# Altium schematic sheet 1_V1.schdoc
size 708 x 330 mm; Name: A_A3; Symbol: A_A3; Device: A_A3; @Project Name: samrtclick; REV: 1.0; Date: 2023-02-28; Sheet: 1/1; Draw By: kano; Company: Your Company; Convert to PCB: yes; Add into BOM: yes
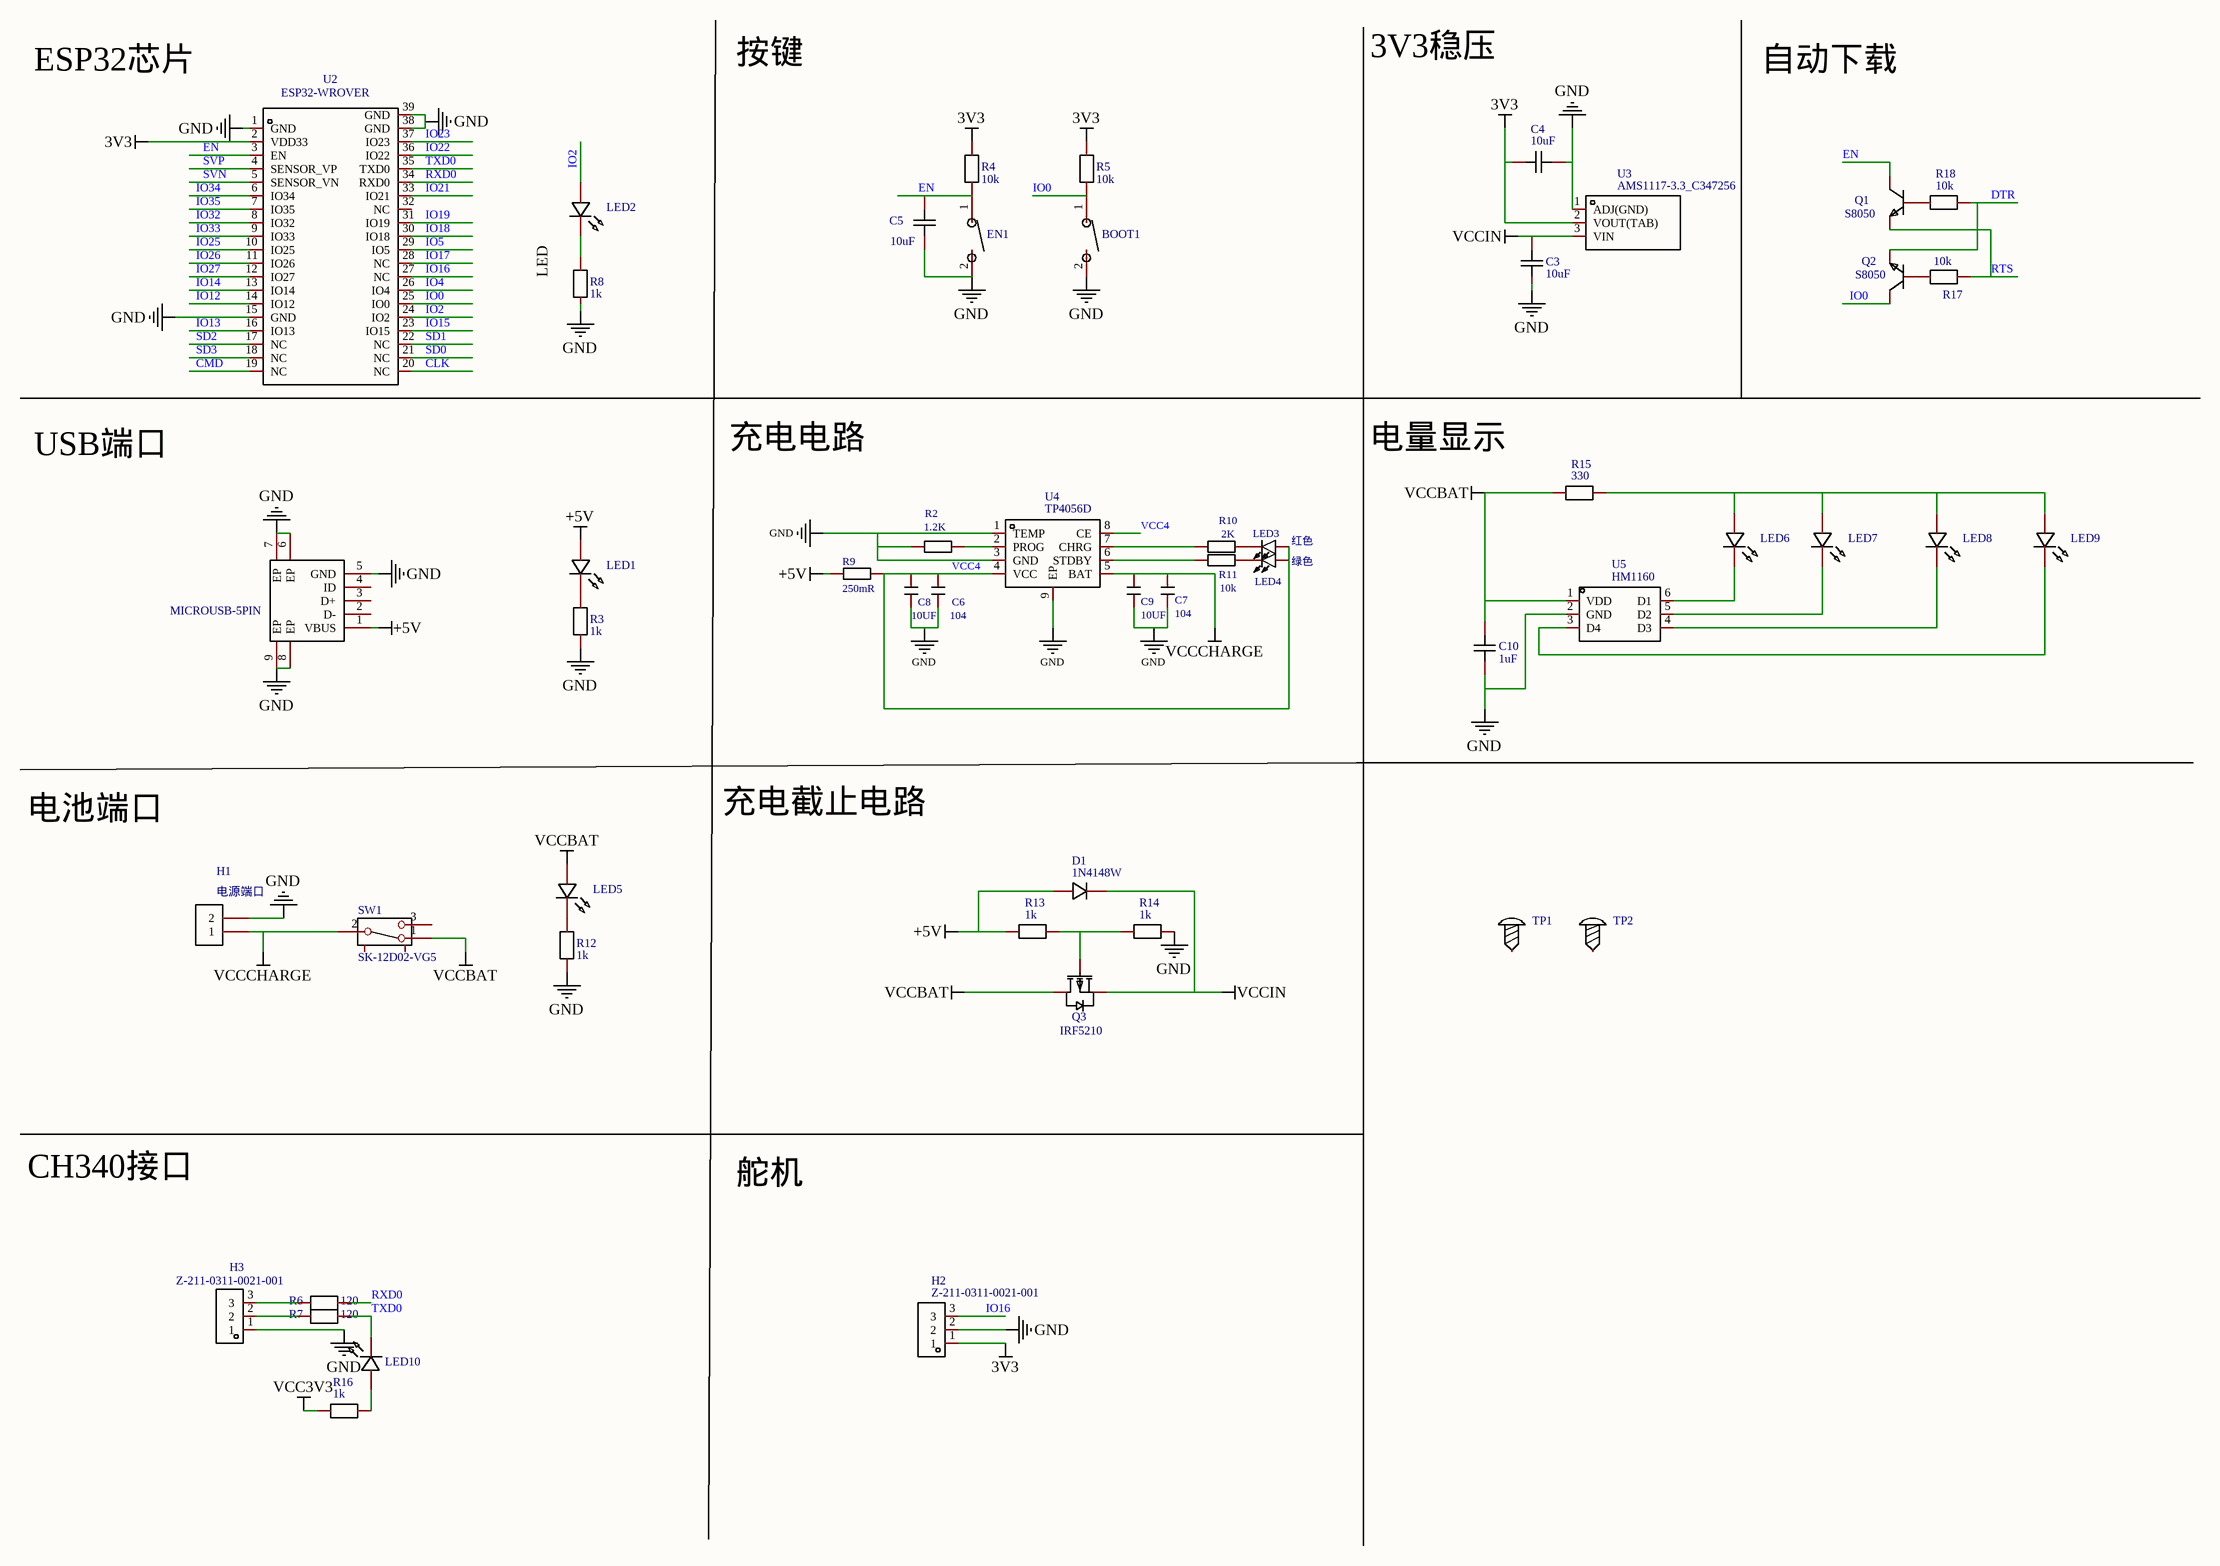
[diagram p0: 1_V1.schdoc]

## Parts
BOOT1  TSA343G00D-250J2  [SW-SMD_L4.0-W2.9-P4.15-EH]  (value not drawn)
C3  10uF  [C0805]
C4  10uF  [C0805]
C5  10uF  [C0603]
C6  104  [C0603]
C7  104  [C0603]
C8  10UF  [C0805]
C9  10UF  [C0805]
C10  1uF  [C0805]
D1  1N4148W  [SOD-123FL_L2.6-W1.6-LS3.4-RD]
EN1  TSA343G00D-250J2  [SW-SMD_L4.0-W2.9-P4.15-EH]  (value not drawn)
H1  电源端口  [HDR-TH_2P-P2.54-V-M-1]
H2  Z-211-0311-0021-001  [HDR-TH_3P-P2.54-V-M-1]
H3  Z-211-0311-0021-001  [HDR-TH_3P-P2.54-V-M-1]
LED1  LED-0603_R  [LED0603_RED]  (value not drawn)
LED2  LED-0603_R  [LED0603_RED]  (value not drawn)
LED3  红色  [L0603-RD]
LED4  绿色  [L0603-RD]
LED5  LED-0603_R  [LED0603_RED]  (value not drawn)
LED6  LED-0603_R  [LED0603_RED]  (value not drawn)
LED7  LED-0603_R  [LED0603_RED]  (value not drawn)
LED8  LED-0603_R  [LED0603_RED]  (value not drawn)
LED9  LED-0603_R  [LED0603_RED]  (value not drawn)
LED10  LED-0603_R  [LED0603_RED]  (value not drawn)
NO1  MICROUSB-5PIN  [USB-SMD_5P_MICROUSB-5PIN]
Q1  S8050  [SOT-23-3_L2.9-W1.3-P1.90-LS2.4-BR]
Q2  S8050  [SOT-23-3_L2.9-W1.3-P1.90-LS2.4-BR]
Q3  IRF5210  [TO-263-2_L10.0-W9.1-P5.08-LS15.2-BR]
R2  1.2K  [R0603]
R3  1k  [R0603]
R4  10k  [R0603]
R5  10k  [R0603]
R6  120  [R0603]
R7  120  [R0603]
R8  1k  [R0603]
R9  250mR  [R1206_1]
R10  2K  [R0603]
R11  10k  [R0603]
R12  1k  [R0603]
R13  1k  [R0603]
R14  1k  [R0603]
R15  330  [R0603]
R16  1k  [R0603]
R17  10k  [R0603]
R18  10k  [R0603]
SW1  SK-12D02-VG5  [SW-TH_SK-12D02-VG5]
TP1  M2螺丝  [M2螺丝]  (value not drawn)
TP2  M2螺丝  [M2螺丝]  (value not drawn)
U2  ESP32-WROVER  [COMM-SMD_ESP-WROOM-32D]
U3  AMS1117-3.3_C347256  [SOT-223-4_L6.5-W3.5-P2.30-LS7.0-BR]
U4  TP4056D  [ESOP-8_L4.9-W3.9-P1.27-LS6.0-TL-EP]
U5  HM1160  [SOT23-6]

## Nets
3V3: C4.1 H2.1 R4.2 R5.2 U2.2(VDD33) U3.2(VOUT(TAB))
+5V: D1.2 LED1.1 NO1.1(VBUS) R9.1 R13.1
GND: BOOT1.2 C3.2 C4.2 C5.1 C6.1 C7.1 C8.1 C9.1 C10.1 EN1.2 H1.2 H2.2 H3.1 NO1.5(GND) NO1.6(EP) NO1.7(EP) NO1.8(EP) NO1.9(EP) R2.1 R3.2 R8.2 R12.2 R14.2 U2.1(GND) U2.15(GND) U2.38(GND) U2.39(GND) U3.1(ADJ(GND)) U4.1(TEMP) U4.3(GND) U4.9(EP) U5.2(GND)
VCC3V3: R16.1
VCCBAT: C10.2 LED5.1 Q3.4(D) R15.1 SW1.1 U5.1(VDD)
VCCCHARGE: C7.2 C9.2 H1.1 SW1.2 U4.5(BAT)
VCCIN: C3.1 D1.1 Q3.3(S) U3.3(VIN)
CLK: U2.20(NC)
CMD: U2.19(NC)
DTR: Q2.2(E) R18.2
EN: C5.2 EN1.1 Q1.3(C) R4.1 U2.3(EN)
IO0: BOOT1.1 Q2.3(C) R5.1 U2.25(IO0)
IO2: LED2.1 U2.24(IO2)
IO4: U2.26(IO4)
IO5: U2.29(IO5)
IO12: U2.14(IO12)
IO13: U2.16(IO13)
IO14: U2.13(IO14)
IO15: U2.23(IO15)
IO16: H2.3 U2.27(NC)
IO17: U2.28(NC)
IO18: U2.30(IO18)
IO19: U2.31(IO19)
IO21: U2.33(IO21)
IO22: U2.36(IO22)
IO23: U2.37(IO23)
IO25: U2.10(IO25)
IO26: U2.11(IO26)
IO27: U2.12(IO27)
IO32: U2.8(IO32)
IO33: U2.9(IO33)
IO34: U2.6(IO34)
IO35: U2.7(IO35)
RTS: Q1.2(E) R17.2
RXD0: R6.2 U2.34(RXD0)
SD0: U2.21(NC)
SD1: U2.22(NC)
SD2: U2.17(NC)
SD3: U2.18(NC)
SVN: U2.5(SENSOR_VN)
SVP: U2.4(SENSOR_VP)
TXD0: LED10.2 R7.2 U2.35(TXD0)
VCC4: C6.2 C8.2 LED3.1(A) LED4.1(A) R9.2 U4.4(VCC) U4.8(CE)
NetH3_2: H3.2 R7.1
NetH3_3: H3.3 R6.1
NetLED1_2: LED1.2 R3.1
NetLED2_2: LED2.2 R8.1
NetLED3_2: LED3.2(K) R10.2
NetLED4_2: LED4.2(K) R11.2
NetLED5_2: LED5.2 R12.1
NetLED6_1: LED6.1 LED7.1 LED8.1 LED9.1 R15.2
NetLED6_2: LED6.2 U5.6(D1)
NetLED7_2: LED7.2 U5.5(D2)
NetLED8_2: LED8.2 U5.4(D3)
NetLED9_2: LED9.2 U5.3(D4)
NetLED10_1: LED10.1 R16.2
NetQ1_1: Q1.1(B) R18.1
NetQ2_1: Q2.1(B) R17.1
NetQ3_1: Q3.1(G) R13.2 R14.1
NetR2_2: R2.2 U4.2(PROG)
NetR10_1: R10.1 U4.7(CHRG)
NetR11_1: R11.1 U4.6(STDBY)

Not connected (* = marked no-connect by the designer): NO1 2(D-) 3(D+) 4(ID); SW1 3 4 5; TP1 1; TP2 1; U2 32(NC)

## Notes on the sheet
- 3V3稳压
- ESP32芯片
- 按键
- 自动下载
- (near R8) LED
- USB端口
- 充电电路
- 电量显示
- 电池端口
- 充电截止电路
- CH340接口
- 舵机
- 1
- 2
- 3
- 4
- 5
- 6
- 7
- 8
- A
- B
- C
- D
- E
- TITLE:
- samrtclick
- REV:
- 1.0
- Date:
- Company:
- 2023-02-28
- Your Company
- Drawn By:
- kano
- Sheet:
- 1/1

## Library data of the parts
BOOT1 EN1 = TSA343G00D-250J2: 触点电流:50mA;额定电压(DC):12V;电路结构:单刀单掷;按钮作用方向:顶部触动;致动器样式:圆形按钮;照明颜色:-;开关长度:4mm;开关宽度:3mm;开关高度:2mm;; Manufacturer: BRIGHT(博瑞泰); Add into BOM: yes; Contact Current: 50mA; Voltage Rating (DC): 12V; Circuit: 单刀单掷; Actuator Orientation: 顶部触动; Actuator Style: 圆形按钮; Switch Length: 4mm; Switch Width: 3mm; Switch Height: 2mm; 3DModel: SW-SMD_L4.0-W2.9-H2-P4.15-EH; Paste Type: expand; Name: TSA343G00D-250J2; Symbol: TSA343G00D-250J2; Device: TSA343G00D-250J2; LCSC Part Name: 3*4 两脚小龟带柱  250gf; Supplier Part: C354947; Manufacturer Part: TSA343G00D-250J2; Supplier Footprint: SMD; JLCPCB Part Class: Extended Part; Datasheet: https://atta.szlcsc.com/upload/public/pdf/source/20190426/C354947_F1C4B323DD8D3B81255E73F8FD6ABFD3.pdf; Supplier: LCSC; Convert to PCB: yes; Illumination Color: -; link: https://item.szlcsc.com/457634.html; Assembly Type: smtWeld; Origin Footprint: SW-SMD_L4.0-W2.9-P4.15-EH
C3 C4 = 10uF: 3DModel: C0805_L2.0-W1.3-H1.3; Add into BOM: yes; Name: 10uF; Symbol: 10uF; Device: 10uF; link: https://item.szlcsc.com/373011.html; Convert to PCB: yes; Origin Footprint: C0805
C5 = 10uF: 3DModel: C0603_L1.6-W0.8-H0.8; Add into BOM: yes; Name: 10uF; Symbol: 10uF; Device: 10uF; link: https://item.szlcsc.com/362304.html; Convert to PCB: yes; Origin Footprint: C0603
C6 C7 = 104: 3DModel: C0603_L1.6-W0.8-H0.8; BOM名称: 无极性贴片电容; 版权归属: 源创客; Add into BOM: yes; Name: 104; Symbol: 104; Device: 104; link: https://item.szlcsc.com/362304.html; 学习资源: www.ooocke.com; Convert to PCB: yes; Origin Footprint: C0603
C8 C9 = 10UF: 3DModel: C0805_L2.0-W1.3-H1.3; BOM名称: 无极性贴片电容; 版权归属: 源创客; Add into BOM: yes; Name: 10UF; Symbol: 10UF; Device: 10UF; link: https://item.szlcsc.com/373011.html; 学习资源: www.ooocke.com; Convert to PCB: yes; Origin Footprint: C0805
C10 = 1uF: 3DModel: C0805_L2.0-W1.3-H1.3; Add into BOM: yes; Name: 1uF; Symbol: 1uF; Device: 1uF; link: https://item.szlcsc.com/373011.html; Convert to PCB: yes; Origin Footprint: C0805
D1 = 1N4148W: Manufacturer: Tak Cheong; 3DModel: SOD-123FL_L2.8-W1.8-H1.1-LS3.6; Add into BOM: yes; Name: 1N4148W; Symbol: 1N4148W; Device: 1N4148W; link: https://atta.szlcsc.com/upload/public/pdf/source/20181106/C323857_0FA3C8BFA639C8DE43C1526AE6096176.pdf; Supplier: LCSC; Manufacturer Part: 1N4148W; Supplier Part: C129216; Convert to PCB: yes; Origin Footprint: SOD-123FL_L2.6-W1.6-LS3.4-RD
H1 = 电源端口: Manufacturer: TE Connectivity(美国泰科); Manufacturer Part: 3-644456-2; 3DModel: HDR-M-2.54_1x2; Add into BOM: yes; Name: 电源端口; Symbol: 电源端口; Device: 电源端口; link: https://item.szlcsc.com/366904.html; Supplier: LCSC; Supplier Part: C90288; JLCPCB Part Class: Extended Part; Convert to PCB: yes; Origin Footprint: HDR-TH_2P-P2.54-V-M-1
H2 H3 = Z-211-0311-0021-001: Manufacturer: Nextron(正凌); 3DModel: HDR-M-2.54_1x3; Add into BOM: yes; Name: Z-211-0311-0021-001; Symbol: Z-211-0311-0021-001; Device: Z-211-0311-0021-001; link: https://item.szlcsc.com/50265.html; Supplier: LCSC; Manufacturer Part: Z-211-0311-0021-001; Supplier Part: C152153; JLCPCB Part Class: Extended Part; Convert to PCB: yes; Origin Footprint: HDR-TH_3P-P2.54-V-M-1
LED1 LED2 LED5-LED10 = LED-0603_R: Manufacturer: EVERLIGHT(台湾亿光); Manufacturer Part: 19-217/R6C-AL1M2VY/3T; Add into BOM: yes; Name: LED-0603_R; Symbol: LED-0603_R; Device: LED-0603_R; 3DModel: LED0603_Red; Supplier Part: C72044; Supplier: LCSC; Convert to PCB: yes; Origin Footprint: LED0603_RED
LED3 = 红色: BOM名称: 贴片LED; 版权归属: 源创客; Add into BOM: yes; Name: 红色; Symbol: 红色; Device: 红色; link: https://atta.szlcsc.com/upload/public/pdf/source/20180326/C98007_E988380F54303ED5DB1EDD3A08ED9857.pdf; 3DModel: L0603-RD; 学习资源: www.ooocke.com; Convert to PCB: yes; Origin Footprint: L0603-RD
LED4 = 绿色: BOM名称: 贴片LED; 版权归属: 源创客; Add into BOM: yes; Name: 绿色; Symbol: 绿色; Device: 绿色; link: https://atta.szlcsc.com/upload/public/pdf/source/20180326/C98007_E988380F54303ED5DB1EDD3A08ED9857.pdf; 3DModel: L0603-RD; 学习资源: www.ooocke.com; Convert to PCB: yes; Origin Footprint: L0603-RD
NO1 = MICROUSB-5PIN: Add into BOM: yes; Name: MICROUSB-5PIN; Symbol: MICROUSB-5PIN; Device: MICROUSB-5PIN; link: https://wenku.baidu.com/view/86fe0d6b3968011ca200912d.html; 3DModel: USB-SMD_5P_MICROUSB-5PIN; Supplier: LCSC; Supplier Part: C9900001196; Manufacturer Part: MicroUSB-5PIN; JLCPCB Part Class: Extended Part; Convert to PCB: yes; Origin Footprint: USB-SMD_5P_MICROUSB-5PIN; NO_CONNECT: yes
Q1 Q2 = S8050: Manufacturer: WPMtek(维攀微); 3DModel: SOT-23-3P_L2.9-W1.3-H1.0-LS2.4-P0.95; Add into BOM: yes; Name: S8050; Symbol: S8050; Device: S8050; link: https://www.diodes.com/assets/Package-Files/SOT23.pdf; Supplier: LCSC; Supplier Part: C2688231; Manufacturer Part: S8050; Convert to PCB: yes; Origin Footprint: SOT-23-3_L2.9-W1.3-P1.90-LS2.4-BR
Q3 = IRF5210: Manufacturer: IR; Manufacturer Part: IRF5210STRLPBF; 3DModel: TO-263-2_L10.2-W8.7-H4.5_LS15.2-P2.54; Paste Type: expand; Add into BOM: yes; Name: IRF5210; Symbol: IRF5210; Device: IRF5210; link: https://item.szlcsc.com/233157.html; Supplier: LCSC; image: //image.lceda.cn/szlcsc/C2622.jpg; Supplier Part: C2622; Convert to PCB: yes; Origin Footprint: TO-263-2_L10.0-W9.1-P5.08-LS15.2-BR
R2 = 1K: BOM名称: 贴片电阻; 版权归属: 源创客; Add into BOM: yes; Name: 1.2K; Symbol: 1K; Device: 1K; 3DModel: R0603; link: https://www.mouser.in/datasheet/2/447/PYu_RT_1_to_0_01_RoHS_L_11-1669912.pdf; 学习资源: www.ooocke.com; Convert to PCB: yes; Origin Footprint: R0603
R3 R8 R12 R16 = 1k: 3DModel: R0603_L1.6-W0.8-H0.8; Add into BOM: yes; Name: 1k; Symbol: 1k; Device: 1k; link: https://item.szlcsc.com/137208.html; Convert to PCB: yes; Origin Footprint: R0603
R4 R5 R17 R18 = 10k: 3DModel: R0603_L1.6-W0.8-H0.8; Add into BOM: yes; Name: 10k; Symbol: 10k; Device: 10k; link: https://item.szlcsc.com/137208.html; Convert to PCB: yes; Origin Footprint: R0603
R6 R7 = 120: 3DModel: R0603_L1.6-W0.8-H0.8; Add into BOM: yes; Name: 120; Symbol: 120; Device: 120; link: https://item.szlcsc.com/137208.html; Convert to PCB: yes; Origin Footprint: R0603
R9 = 250mR: BOM名称: 贴片电阻; 版权归属: 源创客; Add into BOM: yes; Name: 250mR; Symbol: 250mR; Device: 250mR; link: https://item.szlcsc.com/311874.html; 学习资源: www.ooocke.com; Convert to PCB: yes; Origin Footprint: R1206_1
R10 = 2K: BOM名称: 贴片电阻; 版权归属: 源创客; Add into BOM: yes; Name: 2K; Symbol: 2K; Device: 2K; 3DModel: R0603; link: https://www.mouser.in/datasheet/2/447/PYu_RT_1_to_0_01_RoHS_L_11-1669912.pdf; 学习资源: www.ooocke.com; Convert to PCB: yes; Origin Footprint: R0603
R11 = 10k: BOM名称: 贴片电阻; 版权归属: 源创客; Add into BOM: yes; Name: 10k; Symbol: 10k; Device: 10k; 3DModel: R0603; link: https://www.mouser.in/datasheet/2/447/PYu_RT_1_to_0_01_RoHS_L_11-1669912.pdf; 学习资源: www.ooocke.com; Convert to PCB: yes; Origin Footprint: R0603
R13 R14 = 1k: Add into BOM: yes; Name: 1k; Symbol: 1k; Device: 1k; 3DModel: R0603; link: https://www.mouser.in/datasheet/2/447/PYu_RT_1_to_0_01_RoHS_L_11-1669912.pdf; Convert to PCB: yes; Origin Footprint: R0603
R15 = 330: Add into BOM: yes; Name: 330; Symbol: 330; Device: 330; 3DModel: R0603; link: https://www.mouser.in/datasheet/2/447/PYu_RT_1_to_0_01_RoHS_L_11-1669912.pdf; Convert to PCB: yes; Origin Footprint: R0603
SW1 = SK-12D02-VG5_C136722: 额定电流(DC):-;额定电压(DC):-;额定电流(AC):-;额定电压(AC):-;电路结构:单刀双掷;安装方式:卧插;机械寿命:5000;滑钮形状:矩形柱状;引脚样式:PC引脚;工作温度:-25℃~+70℃;开关高度:9.5mm;; Manufacturer: 韩国韩荣; Add into BOM: yes; Circuit: 单刀双掷; Mechanical Life: 5000; Actuator Style: 矩形柱状; Pin Style: PC引脚; Switch Height: 9.5mm; Name: SK-12D02-VG5; Symbol: SK-12D02-VG5; Device: SK-12D02-VG5_C136722; LCSC Part Name: SK-12D02-VG5; Supplier Part: C136722; Manufacturer Part: SK-12D02-VG5; Supplier Footprint: 插件; JLCPCB Part Class: Extended Part; Datasheet: https://atta.szlcsc.com/upload/public/pdf/source/20180731/C136723_39114FC09BF2E9DC98823B78B7234B45.pdf; Supplier: LCSC; Convert to PCB: yes; Current Rating (DC): -; Voltage Rating (DC): -; Current Rating (AC): -; Voltage Rating (AC): -; Mounting Style: 卧插; Operating Temperature: -25℃~+70℃; NO_CONNECT: yes
TP1 TP2 = M2螺丝: Symbol: 螺丝孔; Convert to PCB: yes; Device: M2螺丝; Add into BOM: yes; Supplier Footprint: 插件
U2 = ESP32-WROVER: Manufacturer: Espressif Systems; Manufacturer Part: ESP32-WROVER-E(16MB); Add into BOM: yes; Name: ESP32-WROVER; Symbol: ESP32-WROVER; Device: ESP32-WROVER; link: https://img.jlc.com//pdf/applyPasteComponent/2021-09-03/497785R/64a6beea460f44a188b4dca376b1da53/%E5%B0%8F%E7%B1%B3ESP-WROOM-32D%E6%A8%A1%E7%BB%84.pdf; 3DModel: COMM-SMD_ESP-WROOM-32D; Supplier: LCSC; Supplier Part: C529589; JLCPCB Part Class: Extended Part; Convert to PCB: yes; Origin Footprint: COMM-SMD_ESP-WROOM-32D; NO_CONNECT: yes
U3 = AMS1117-3.3_C347256: Manufacturer: Youtai Semiconductor Co., Ltd.; 3DModel: SOT-223-4P_L6.5-W3.5-H1.6-LS7.0-P2.30; Paste Type: expand; Add into BOM: yes; Name: AMS1117-3.3_C347256; Symbol: AMS1117-3.3_C347256; Device: AMS1117-3.3_C347256; link: https://item.szlcsc.com/84517.html; Supplier: LCSC; Supplier Part: C347256; Manufacturer Part: AMS1117-3.3; Assembly Type: smtWeld; Convert to PCB: yes; Origin Footprint: SOT-223-4_L6.5-W3.5-P2.30-LS7.0-BR
U4 = TP4056D: Manufacturer: 拓微集成; 3DModel: ESOP-8_L4.9-W3.9-H1.6-LS6.0-P1.27; Add into BOM: yes; Name: TP4056D; Symbol: TP4056D; Device: TP4056D; link: https://img.jlc.com/pdf/applyPasteComponent/2022-01-14/296412A/fe074eb14c014e62a4772fc0c12ab405/TP4056D.pdf; Supplier: LCSC; Supplier Part: C9900006240; Manufacturer Part: TP4056D; JLCPCB Part Class: Extended Part; Convert to PCB: yes; Origin Footprint: ESOP-8_L4.9-W3.9-P1.27-LS6.0-TL-EP
U5 = HM1160: Manufacturer: Shenzhen Chip Hope Micro-Electronics; Manufacturer Part: LP3772-1; Add into BOM: yes; Name: HM1160; Symbol: HM1160; Device: HM1160; Supplier: LCSC; Supplier Part: C360132; Convert to PCB: yes; Origin Footprint: SOT23-6